# EAGLE design adapter (EAGLE 6.5.0)
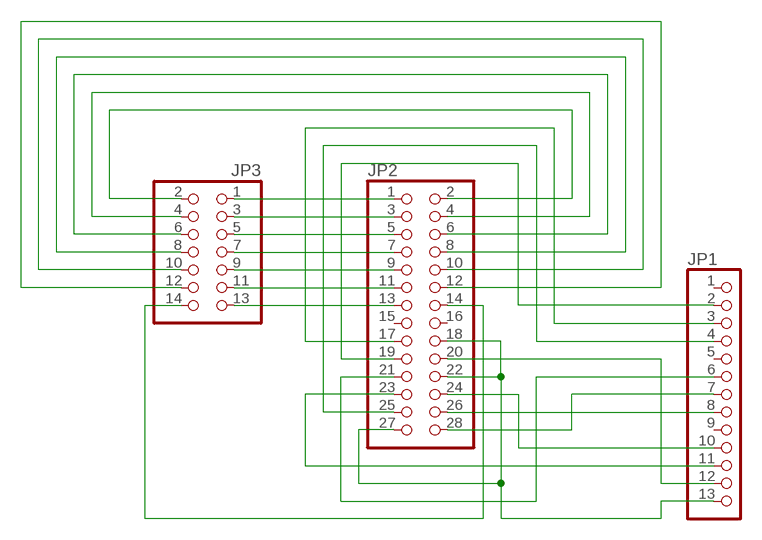
[diagram p0: schematic, sheet 1]

## Parts
JP1  PINHD-1X13  [1X13]
JP2  PINHD-2X14  [2X14]
JP3  PINHD-2X7  [2X07]

## Nets
GND: JP1.13 JP2.18 JP2.22 JP2.27
N$2: JP1.3 JP2.17
N$3: JP1.4 JP2.25
N$5: JP1.7 JP2.28
N$6: JP1.12 JP2.20
N$7: JP1.8 JP2.26
N$8: JP1.2 JP2.19
N$9: JP1.6 JP2.21
N$10: JP1.11 JP2.23
N$11: JP2.1 JP3.1
N$12: JP2.3 JP3.3
N$13: JP2.5 JP3.5
N$14: JP2.7 JP3.7
N$15: JP2.9 JP3.9
N$16: JP2.11 JP3.11
N$17: JP2.13 JP3.13
N$18: JP2.2 JP3.2
N$19: JP2.4 JP3.4
N$20: JP2.6 JP3.6
N$21: JP2.8 JP3.8
N$22: JP2.10 JP3.10
N$23: JP2.12 JP3.12
N$24: JP2.14 JP3.14
N$25: JP1.10 JP2.24
Unconnected: JP1.1 JP1.5 JP1.9 JP2.15 JP2.16

## Library data of the parts
JP1 = pinhead:PINHD-1X13: PIN HEADER
JP2 = pinhead:PINHD-2X14: PIN HEADER
JP3 = pinhead:PINHD-2X7: PIN HEADER

## Board
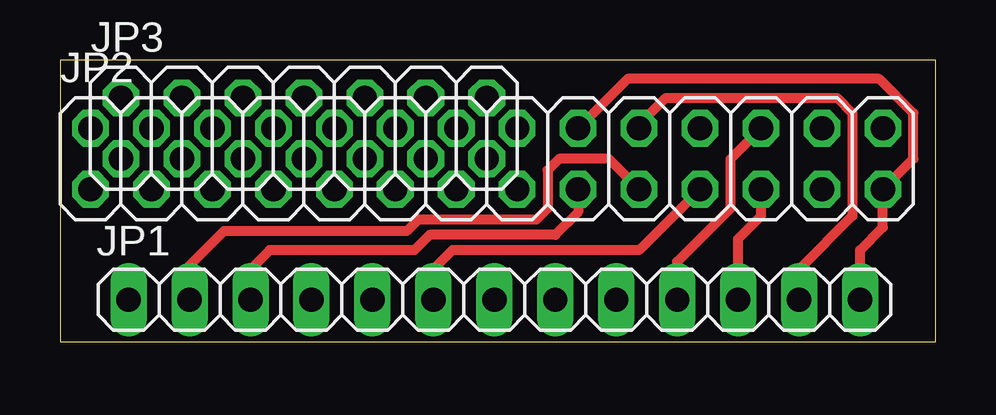
[diagram p1: board, top side]
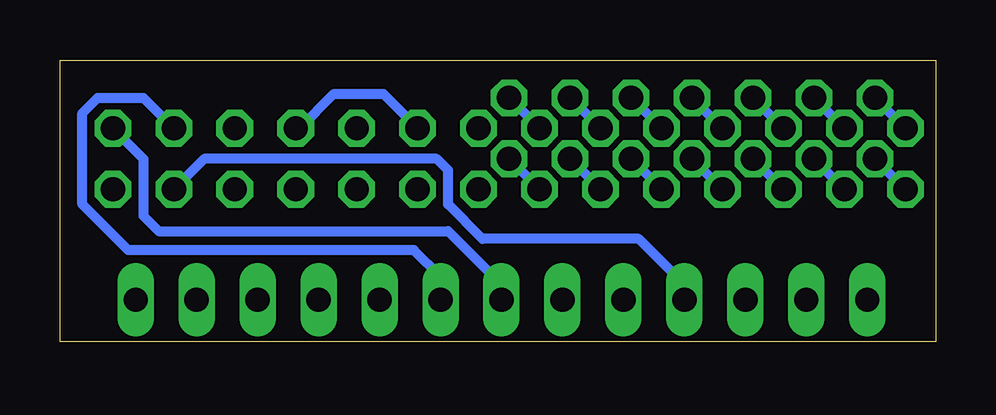
[diagram p2: board, bottom side, seen from below]

Size 36.49 x 11.73 mm. Coordinates in mm from the lower left corner, seen from the top.
Outline: 0,0 36.49,0 36.49,11.73 0,11.73 0,0
Copper layers (1*16): Top 0.035mm / dielectric 1.5mm / Bottom 0.035mm
Design rules "default": minimum track width 10mil, minimum drill 24mil, track to track 8mil, track to pad 8mil, pad to pad 8mil, via to via 8mil, smd to smd 8mil, copper to edge 40mil, drill to drill 8mil, minimum pad ring 10mil, minimum via ring 8mil, stop-mask expansion 4mil, vias tented up to drill 0mil, thermal gap 10mil

### Footprints (pad centres in the part's own frame; a part is rotated, then mirrored left to right if it is on the bottom)
1X13 = drill 1.016 long: 1 -15.24,0; 2 -12.7,0; 3 -10.16,0; 4 -7.62,0; 5 -5.08,0; 6 -2.54,0; 7 0,0; 8 2.54,0; 9 5.08,0; 10 7.62,0; 11 10.16,0; 12 12.7,0; 13 15.24,0
2X14 = drill 1.016 octagon: 1 -16.51,-1.27; 2 -16.51,1.27; 3 -13.97,-1.27; 4 -13.97,1.27; 5 -11.43,-1.27; 6 -11.43,1.27; 7 -8.89,-1.27; 8 -8.89,1.27; 9 -6.35,-1.27; 10 -6.35,1.27; 11 -3.81,-1.27; 12 -3.81,1.27; 13 -1.27,-1.27; 14 -1.27,1.27; 15 1.27,-1.27; 16 1.27,1.27; 17 3.81,-1.27; 18 3.81,1.27; 19 6.35,-1.27; 20 6.35,1.27; 21 8.89,-1.27; 22 8.89,1.27; 23 11.43,-1.27; 24 11.43,1.27; 25 13.97,-1.27; 26 13.97,1.27; 27 16.51,-1.27; 28 16.51,1.27
2X07 = drill 1.016 octagon: 1 -7.62,-1.27; 2 -7.62,1.27; 3 -5.08,-1.27; 4 -5.08,1.27; 5 -2.54,-1.27; 6 -2.54,1.27; 7 0,-1.27; 8 0,1.27; 9 2.54,-1.27; 10 2.54,1.27; 11 5.08,-1.27; 12 5.08,1.27; 13 7.62,-1.27; 14 7.62,1.27

### Placement (x,y rotation side)
JP1  18.1,1.75 0 top
JP2  17.78,7.62 0 top
JP3  10.16,8.89 0 top

### Tracks (layer width: path | path; a pad name or v marks a point on that pad's centre or on a via)
GND
  Top 0.406: JP1.13 33.34,3.81 34.29,4.76 JP2.27 35.56,7.62 35.56,9.53 34.13,10.95 23.65,10.95 JP2.18
  Bottom 0.406: JP2.22 26.51,8.89 25.08,10.32 23.02,10.32 JP2.18
N$2
  Top 0.406: JP2.17 21.59,5.4 20.64,4.45 15.4,4.45 14.76,3.81 8.73,3.81 7.94,3.02 JP1.3
N$3
  Bottom 0.406: JP1.4 10.48,2.38 12.38,4.29 18.89,4.29 20.32,5.71 20.32,7.14 20.8,7.62 30.48,7.62 JP2.25
N$5
  Bottom 0.406: JP2.28 33.02,7.62 33.02,5.24 32.38,4.6 20.32,4.6 18.1,2.38 JP1.7
N$6
  Top 0.406: JP2.20 24.13,9.05 25.24,10.16 32.38,10.16 33.02,9.53 33.02,5.24 30.8,3.02 JP1.12
N$7
  Bottom 0.406: JP1.8 20.64,2.7 21.75,3.81 33.66,3.81 35.56,5.71 35.56,9.53 34.92,10.16 33.02,10.16 JP2.26
N$8
  Top 0.406: JP2.19 22.86,7.62 20.8,7.62 20.32,7.14 20.32,5.56 19.84,5.08 14.92,5.08 14.45,4.6 6.83,4.6 5.4,3.17 JP1.2
N$9
  Top 0.406: JP2.21 24.13,3.81 16.35,3.81 15.56,3.02 JP1.6
N$10
  Top 0.406: JP1.11 28.26,4.29 29.21,5.24 JP2.23
N$11
  Bottom 0.406: JP3.1 JP2.1
N$12
  Bottom 0.406: JP3.3 JP2.3
N$13
  Bottom 0.406: JP3.5 JP2.5
N$14
  Bottom 0.406: JP3.7 JP2.7
N$15
  Bottom 0.406: JP3.9 JP2.9
N$16
  Bottom 0.406: JP3.11 JP2.11
N$17
  Bottom 0.406: JP3.13 JP2.13
N$18
  Bottom 0.406: JP3.2 JP2.2
N$19
  Bottom 0.406: JP3.4 JP2.4
N$20
  Bottom 0.406: JP2.6 JP3.6
N$21
  Bottom 0.406: JP3.8 JP2.8
N$22
  Bottom 0.406: JP3.10 JP2.10
N$23
  Bottom 0.406: JP3.12 JP2.12
N$24
  Bottom 0.406: JP3.14 JP2.14
N$25
  Top 0.406: JP1.10 25.72,3.33 27.94,5.56 27.94,7.62 JP2.24